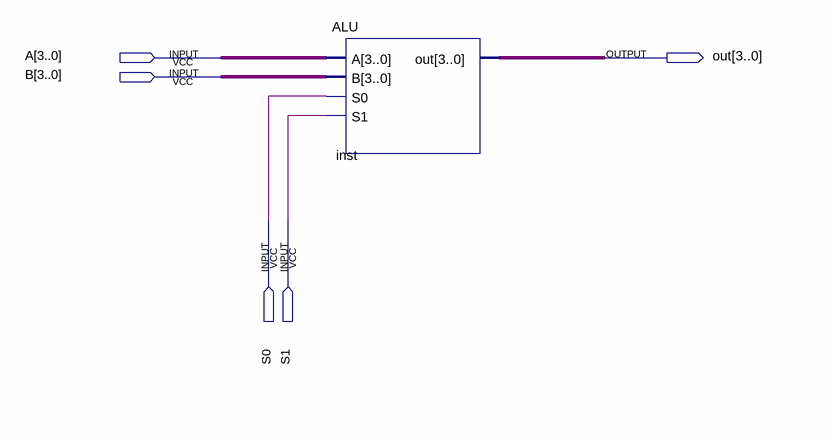
[diagram p0: schematic sheet]
// Quartus schematic Final.bdf as structural Verilog: 1 symbols, 5 pins
module Final (
  input  [3:0] A,
  input  [3:0] B,
  input  S0,
  input  S1,
  output [3:0] out
);

  ALU inst (.A(A), .B(B), .S0(S0), .S1(S1), .out(out));
endmodule
